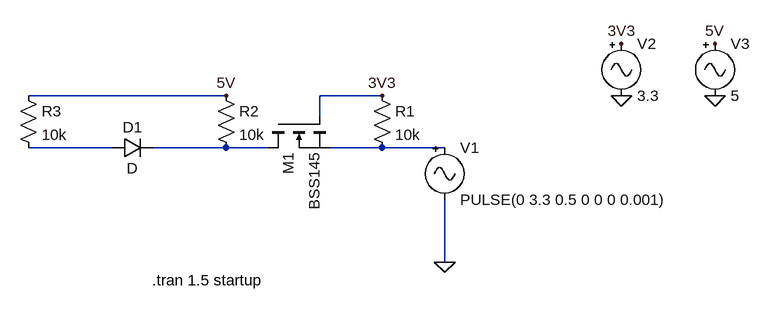
[diagram p0: schematic level_shift.asc]
level_shift.asc, the LTspice schematic file:
Version 4
SHEET 1 900 680
WIRE 80 -560 -224 -560
WIRE 320 -560 224 -560
WIRE 224 -528 224 -560
WIRE -96 -480 -224 -480
WIRE 80 -480 -32 -480
WIRE 144 -480 80 -480
WIRE 320 -480 240 -480
WIRE 416 -480 320 -480
WIRE 416 -304 416 -400
FLAG 416 -304 0
FLAG 688 -560 0
FLAG 688 -640 3V3
FLAG 320 -560 3V3
FLAG 832 -560 0
FLAG 832 -640 5V
FLAG 80 -560 5V
SYMBOL nmos 144 -528 M90
SYMATTR InstName M1
SYMATTR Value BSS145
SYMBOL Misc\\signal 416 -496 R0
WINDOW 123 0 0 Left 0
WINDOW 39 0 0 Left 0
SYMATTR InstName V1
SYMATTR Value PULSE(0 3.3 0.5 0 0 0 0.001)
SYMBOL res 304 -576 R0
SYMATTR InstName R1
SYMATTR Value 10k
SYMBOL Misc\\signal 688 -656 R0
WINDOW 123 0 0 Left 0
WINDOW 39 0 0 Left 0
SYMATTR InstName V2
SYMATTR Value 3.3
SYMBOL Misc\\signal 832 -656 R0
WINDOW 123 0 0 Left 0
WINDOW 39 0 0 Left 0
SYMATTR InstName V3
SYMATTR Value 5
SYMBOL res 64 -576 R0
SYMATTR InstName R2
SYMATTR Value 10k
SYMBOL diode -96 -464 R270
WINDOW 0 32 32 VTop 2
WINDOW 3 0 32 VBottom 2
SYMATTR InstName D1
SYMBOL res -240 -576 R0
SYMATTR InstName R3
SYMATTR Value 10k
TEXT -34 -276 Left 2 !.tran 1.5 startup

The netlist it stands for:
* level_shift.asc
M1 N002 3V3 N003 N003 BSS145
V1 N003 0 PULSE(0 3.3 0.5 0 0 0 0.001)
R1 3V3 N003 10k
V2 3V3 0 3.3
V3 5V 0 5
R2 5V N002 10k
D1 N001 N002 D
R3 5V N001 10k
.model D D
.lib standard.dio
.model NMOS NMOS
.model PMOS PMOS
.lib standard.mos
.tran 1.5 startup
.backanno
.end